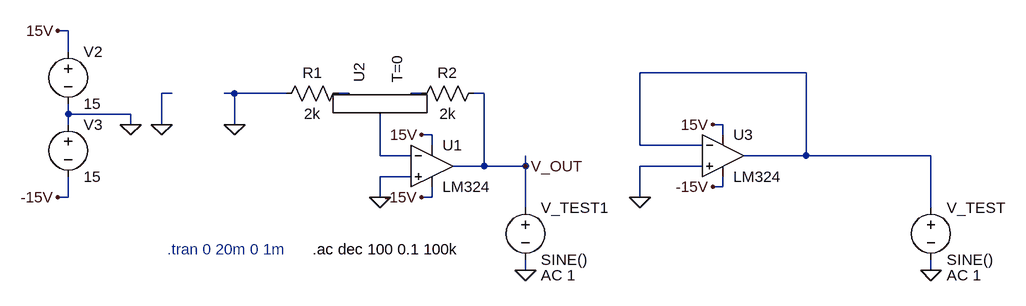
[diagram p0: schematic LM324 Output Impedance.asc]
LM324 Output Impedance.asc, the LTspice schematic file:
Version 4
SHEET 1 1164 680
WIRE -272 0 -288 0
WIRE -272 32 -272 0
WIRE 864 64 608 64
WIRE -112 96 -128 96
WIRE -16 96 -32 96
WIRE 64 96 -16 96
WIRE 160 96 144 96
WIRE 272 96 256 96
WIRE 368 96 352 96
WIRE -272 128 -272 112
WIRE -176 128 -272 128
WIRE -272 144 -272 128
WIRE -176 144 -176 128
WIRE -128 144 -128 96
WIRE -16 144 -16 96
WIRE 736 144 720 144
WIRE 288 160 272 160
WIRE 736 160 736 144
WIRE 288 176 288 160
WIRE 608 176 608 64
WIRE 704 176 608 176
WIRE 208 192 208 128
WIRE 256 192 208 192
WIRE 864 192 864 64
WIRE 864 192 768 192
WIRE 1056 192 864 192
WIRE 368 208 368 96
WIRE 368 208 320 208
WIRE 432 208 432 192
WIRE 432 208 368 208
WIRE 704 208 608 208
WIRE 256 224 208 224
WIRE 736 240 736 224
WIRE 736 240 720 240
WIRE -272 256 -272 224
WIRE -272 256 -288 256
WIRE 208 256 208 224
WIRE 288 256 288 240
WIRE 288 256 272 256
WIRE 608 256 608 208
WIRE 432 272 432 208
WIRE 1056 272 1056 192
WIRE 432 368 432 352
WIRE 1056 368 1056 352
FLAG 272 160 15V
FLAG -128 144 0
FLAG 208 256 0
FLAG 272 256 -15V
FLAG -176 144 0
FLAG -288 0 15V
FLAG -288 256 -15V
FLAG 1056 368 0
FLAG -16 144 0
FLAG 432 208 V_OUT
FLAG 720 144 15V
FLAG 720 240 -15V
FLAG 608 256 0
FLAG 432 368 0
SYMBOL LM324 288 208 R0
SYMATTR InstName U1
SYMBOL res 160 80 R90
WINDOW 0 0 56 VBottom 2
WINDOW 3 32 56 VTop 2
SYMATTR InstName R1
SYMATTR Value 2k
SYMBOL res 368 80 R90
WINDOW 0 0 56 VBottom 2
WINDOW 3 32 56 VTop 2
SYMATTR InstName R2
SYMATTR Value 2k
SYMBOL voltage -272 16 R0
WINDOW 123 0 0 Left 0
WINDOW 39 0 0 Left 0
SYMATTR InstName V2
SYMATTR Value 15
SYMBOL voltage -272 128 R0
WINDOW 123 0 0 Left 0
WINDOW 39 0 0 Left 0
SYMATTR InstName V3
SYMATTR Value 15
SYMBOL voltage 1056 256 R0
WINDOW 123 24 120 Left 2
WINDOW 39 0 0 Left 0
SYMATTR Value2 AC 1
SYMATTR InstName V_TEST
SYMATTR Value SINE()
SYMBOL EXTRA\\Misc\\pot 208 96 R270
WINDOW 0 16 -32 Left 2
WINDOW 3 17 -1 Left 2
WINDOW 123 16 26 Left 2
SYMATTR InstName U2
SYMATTR Value2 T=0
SYMBOL LM324 736 192 R0
SYMATTR InstName U3
SYMBOL voltage 432 256 R0
WINDOW 123 24 120 Left 2
WINDOW 39 0 0 Left 0
SYMATTR Value2 AC 1
SYMATTR InstName V_TEST1
SYMATTR Value SINE()
TEXT -120 336 Left 2 ;.tran 0 20m 0 1m
TEXT 104 336 Left 2 !.ac dec 100 0.1 100k

The netlist it stands for:
* LM324 Output Impedance.asc
* U1: LM324 (symbol LM324 not available, pins judged from their places): In+=0 In-=N004 V+=15V V-=-15V OUT=V_OUT
R1 N002 0 2k
R2 V_OUT N003 2k
V2 15V 0 15
V3 0 -15V 15
V_TEST N001 0 SINE() AC 1
XU2 N002 N003 N004 T=0
* U3: LM324 (symbol LM324 not available, pins judged from their places): In+=0 In-=N001 V+=15V V-=-15V OUT=N001
V_TEST1 V_OUT 0 SINE() AC 1
* .tran 0 20m 0 1m
.ac dec 100 0.1 100k
.lib POT.lib
.backanno
.end